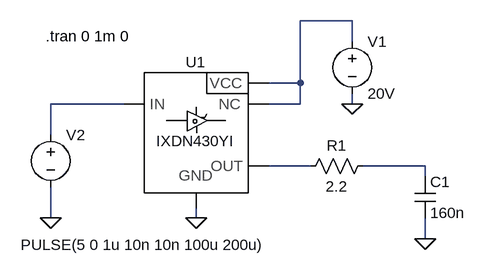
[diagram p0: schematic IXDN430YI-TEST1.asc]
IXDN430YI-TEST1.asc, the LTspice schematic file:
Version 4
SHEET 1 900 680
WIRE 544 16 464 16
WIRE 544 48 544 16
WIRE 464 112 464 16
WIRE 464 112 416 112
WIRE 192 144 80 144
WIRE 464 144 464 112
WIRE 464 144 416 144
WIRE 544 144 544 128
WIRE 80 192 80 144
WIRE 480 240 416 240
WIRE 656 240 560 240
WIRE 656 256 656 240
WIRE 80 320 80 272
WIRE 304 320 304 304
WIRE 656 352 656 320
FLAG 544 144 0
FLAG 80 320 0
FLAG 304 320 0
FLAG 656 352 0
SYMBOL voltage 544 32 R0
WINDOW 123 0 0 Left 0
WINDOW 39 0 0 Left 0
SYMATTR InstName V1
SYMATTR Value 20V
SYMBOL voltage 80 176 R0
WINDOW 3 -46 185 Left 0
WINDOW 123 0 0 Left 0
WINDOW 39 0 0 Left 0
SYMATTR Value PULSE(5 0 1u 10n 10n 100u 200u)
SYMATTR InstName V2
SYMBOL cap 640 256 R0
SYMATTR InstName C1
SYMATTR Value 160n
SYMBOL res 576 224 R90
WINDOW 0 0 56 VBottom 0
WINDOW 3 32 56 VTop 0
SYMATTR InstName R1
SYMATTR Value 2.2
SYMBOL IXDN430YI 304 64 R0
SYMATTR InstName U1
TEXT 72 40 Left 0 !.tran 0 1m 0

The netlist it stands for:
* IXDN430YI-TEST1.asc
V1 N001 0 20V
V2 N002 0 PULSE(5 0 1u 10n 10n 100u 200u)
C1 N004 0 160n
R1 N004 N003 2.2
XU1 N001 N003 0 N002 N001 IXDN430YI  ; pins VCC OUT GND IN NC
.tran 0 1m 0
.lib IXDN430YI_lt.lib
.backanno
.end